# EAGLE design EmonMbed (EAGLE 7.2.0)
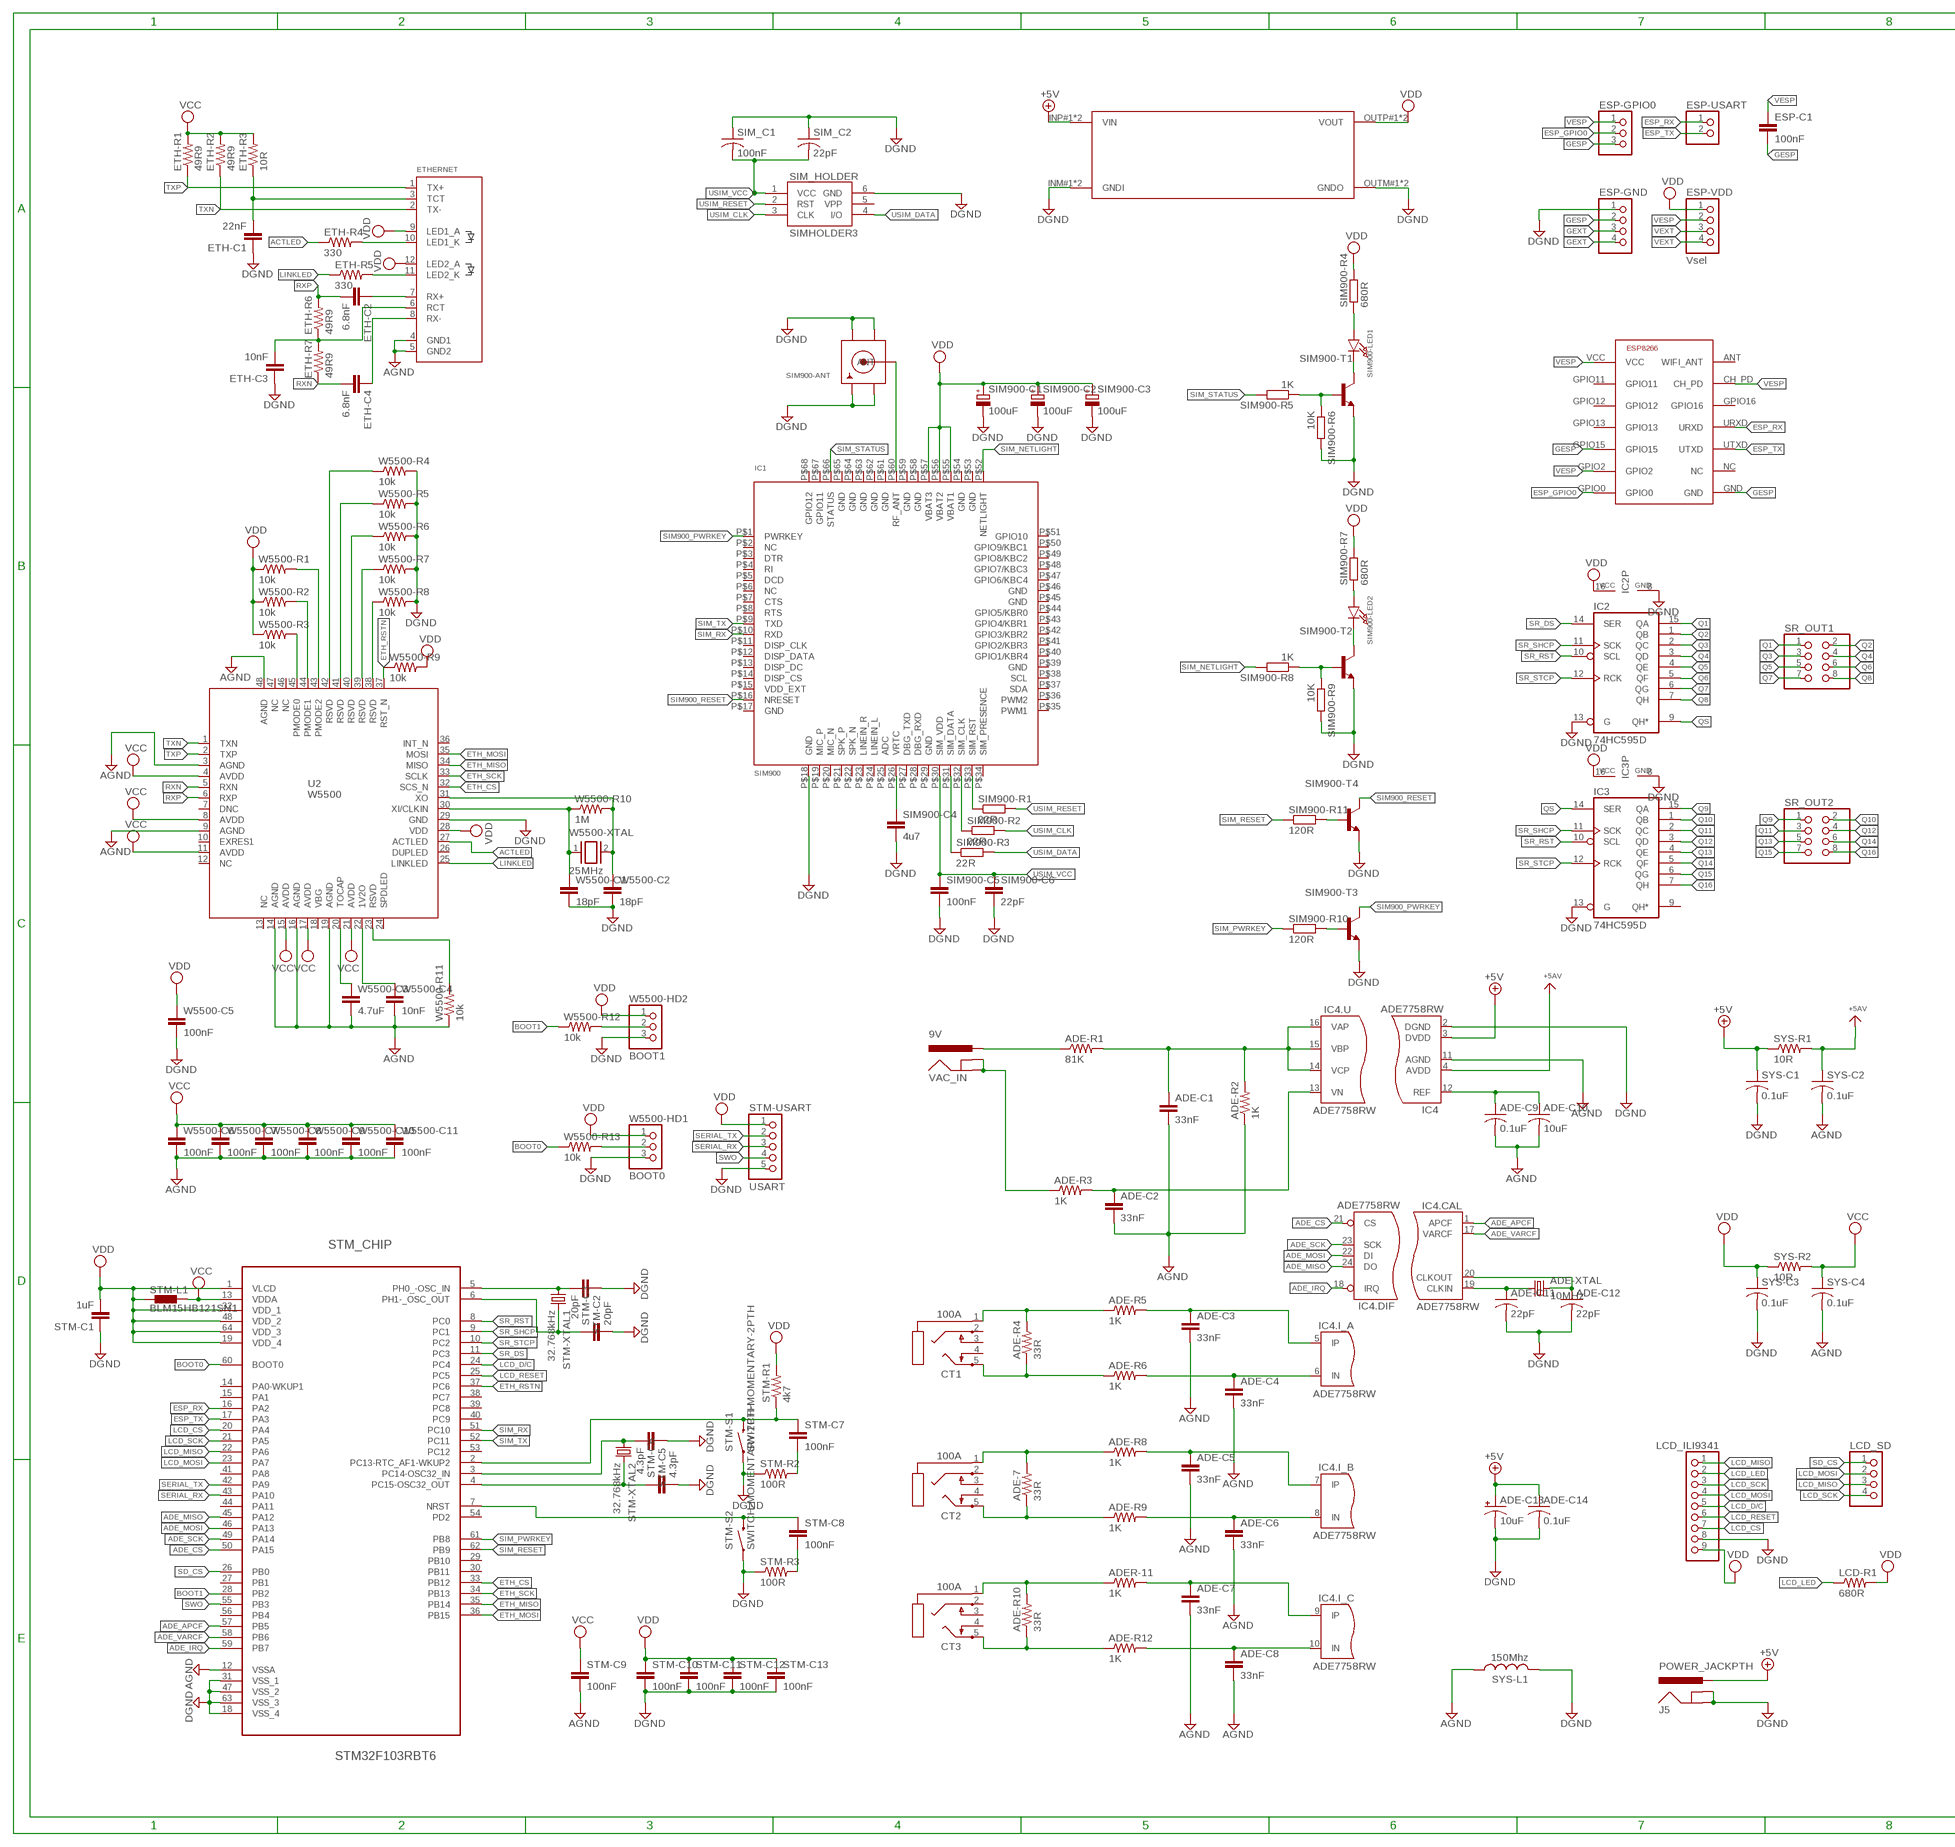
[diagram p0: schematic, sheet 1, part 1 of 2]
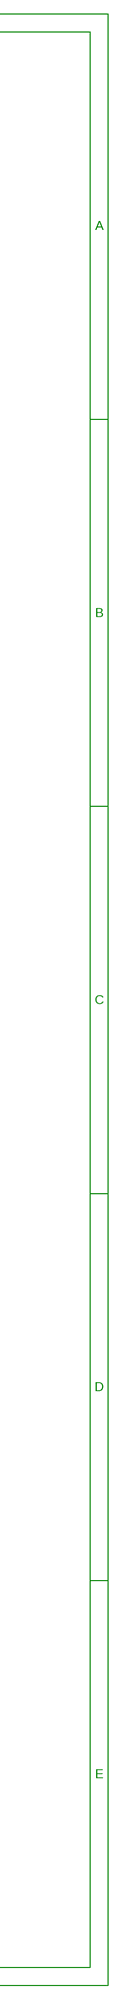
[diagram p1: schematic, sheet 1, part 2 of 2]

## Parts
ADE-7  33R  RESISTOR0603-RES  [0603-RES]
ADE-C1  33nF  CAP0603-CAP  [0603-CAP]
ADE-C2  33nF  CAP0603-CAP  [0603-CAP]
ADE-C3  33nF  CAP0603-CAP  [0603-CAP]
ADE-C4  33nF  CAP0603-CAP  [0603-CAP]
ADE-C5  33nF  CAP0603-CAP  [0603-CAP]
ADE-C6  33nF  CAP0603-CAP  [0603-CAP]
ADE-C7  33nF  CAP0603-CAP  [0603-CAP]
ADE-C8  33nF  CAP0603-CAP  [0603-CAP]
ADE-C9  0.1uF  C-USC0805K  [C0805K]
ADE-C10  10uF  C-USC0805K  [C0805K]
ADE-C11  22pF  C-USC0805K  [C0805K]
ADE-C12  22pF  C-USC0805K  [C0805K]
ADE-C13  10uF  CPOL-USC/6032-28R  [C/6032-28R]
ADE-C14  0.1uF  C-USC0805  [C0805]
ADE-R1  81K  RESISTOR0603-RES  [0603-RES]
ADE-R2  1K  RESISTOR0603-RES  [0603-RES]
ADE-R3  1K  RESISTOR0603-RES  [0603-RES]
ADE-R4  33R  RESISTOR0603-RES  [0603-RES]
ADE-R5  1K  RESISTOR0603-RES  [0603-RES]
ADE-R6  1K  RESISTOR0603-RES  [0603-RES]
ADE-R8  1K  RESISTOR0603-RES  [0603-RES]
ADE-R9  1K  RESISTOR0603-RES  [0603-RES]
ADE-R10  33R  RESISTOR0603-RES  [0603-RES]
ADE-R12  1K  RESISTOR0603-RES  [0603-RES]
ADE-XTAL  10MHz  CRYSTALHC49US  [HC49US]
ADER-11  1K  RESISTOR0603-RES  [0603-RES]
CT1  100A  AUDIO_STEREOJACK  [STX3100]
CT2  100A  AUDIO_STEREOJACK  [STX3100]
CT3  100A  AUDIO_STEREOJACK  [STX3100]
DCDC-3.5V  DCDCMODULE_SMALL  [DCDCMODULE-SMALL]
ESP8266  ESP-07  [ESP-07]
ESP-C1  100nF  C-EUC0603  [C0603]
ESP-GND  PINHD-1X4  [1X04]
ESP-GPIO0  PINHD-1X3  [1X03]
ESP-USART  PINHD-1X2  [1X02]
ESP-VDD  Vsel  PINHD-1X4  [1X04]
ETH-C1  22nF  C-EUC0603  [C0603]
ETH-C2  6.8nF  C-EUC0603  [C0603]
ETH-C3  10nF  C-EUC0603  [C0603]
ETH-C4  6.8nF  C-EUC0603  [C0603]
ETH-R1  49R9  R-US_R0603  [R0603]
ETH-R2  49R9  R-US_R0603  [R0603]
ETH-R3  10R  R-US_R0603  [R0603]
ETH-R4  330  R-US_R0603  [R0603]
ETH-R5  330  R-US_R0603  [R0603]
ETH-R6  49R9  R-US_R0603  [R0603]
ETH-R7  49R9  R-US_R0603  [R0603]
ETHERNET  RJ45J0026D21BNL  [RJ45_PULSEJACK]
IC1  SIM900  GSM_SIM900_LITERAL  [SIM900_SMT]
IC2  74HC595D  [SO16]
IC3  74HC595D  [SO16]
IC4  ADE7758RW  [SOIC24]
J5  POWER_JACKPTH  [POWER_JACK_PTH]
LCD-R1  680R  RESISTOR0603-RES  [0603-RES]
LCD_ILI9341  PINHD-1X9  [1X09]
LCD_SD  PINHD-1X4  [1X04]
SIM900-ANT  SMACONNECTOR  [SMA90_DIP]
SIM900-C1  100uF  CPOL-EU153CLV-0605  [153CLV-0605]
SIM900-C2  100uF  CPOL-EU153CLV-0605  [153CLV-0605]
SIM900-C3  100uF  CPOL-EU153CLV-0605  [153CLV-0605]
SIM900-C4  4u7  C-EUC0603  [C0603]
SIM900-C5  100nF  C-EUC0603  [C0603]
SIM900-C6  22pF  C-EUC0603  [C0603]
SIM900-LED1  LED0805_NOOUTLINE  [CHIPLED_0805_NOOUTLINE]
SIM900-LED2  LED0805_NOOUTLINE  [CHIPLED_0805_NOOUTLINE]
SIM900-R1  22R  R-EU_R0603  [R0603]
SIM900-R2  22R  R-EU_R0603  [R0603]
SIM900-R3  22R  R-EU_R0603  [R0603]
SIM900-R4  680R  R-EU_R0603  [R0603]
SIM900-R5  1K  R-EU_R0603  [R0603]
SIM900-R6  10K  R-EU_R0603  [R0603]
SIM900-R7  680R  R-EU_R0603  [R0603]
SIM900-R8  1K  R-EU_R0603  [R0603]
SIM900-R9  10K  R-EU_R0603  [R0603]
SIM900-R10  120R  R-EU_R0603  [R0603]
SIM900-R11  120R  R-EU_R0603  [R0603]
SIM900-T1  MMBT2222ALT1-NPN-SOT23-BEC  [SOT23-BEC]
SIM900-T2  MMBT2222ALT1-NPN-SOT23-BEC  [SOT23-BEC]
SIM900-T3  MMBT2222ALT1-NPN-SOT23-BEC  [SOT23-BEC]
SIM900-T4  MMBT2222ALT1-NPN-SOT23-BEC  [SOT23-BEC]
SIM_C1  100nF  C-USC0603K  [C0603K]
SIM_C2  22pF  C-USC0603K  [C0603K]
SIM_HOLDER  SIMHOLDER3  [SIMHOLDER3]
SR_OUT1  PINHD-2X4/90  [2X04/90]
SR_OUT2  PINHD-2X4/90  [2X04/90]
STM-C1  1uF  C-EUC0603  [C0603]
STM-C2  20pF  C-EUC0603  [C0603]
STM-C3  20pF  C-EUC0603  [C0603]
STM-C5  4.3pF  C-EUC0603  [C0603]
STM-C6  4.3pF  C-EUC0603  [C0603]
STM-C7  100nF  C-EUC0603  [C0603]
STM-C8  100nF  C-EUC0603  [C0603]
STM-C9  100nF  C-EUC0603  [C0603]
STM-C10  100nF  C-EUC0603  [C0603]
STM-C11  100nF  C-EUC0603  [C0603]
STM-C12  100nF  C-EUC0603  [C0603]
STM-C13  100nF  C-EUC0603  [C0603]
STM-L1  BLM15HB121SN1  [0402]
STM-R1  4k7  R-US_R0603  [R0603]
STM-R2  100R  R-US_R0603  [R0603]
STM-R3  100R  R-US_R0603  [R0603]
STM-S1  SWITCH-MOMENTARY-2PTH  [TACTILE-PTH]
STM-S2  SWITCH-MOMENTARY-2PTH  [TACTILE-PTH]
STM-USART  USART  PINHD-1X5  [1X05]
STM-XTAL1  32.768kHz  CRYSTALTC26H  [TC26H]
STM-XTAL2  32.768kHz  CRYSTALTC26H  [TC26H]
STM_CHIP  STM32F103RBT6  STM32L152RBT6  [QFP50P1200X1200X160-64N]
SYS-C1  0.1uF  C-USC0805  [C0805]
SYS-C2  0.1uF  C-USC0805  [C0805]
SYS-C3  0.1uF  C-USC0805  [C0805]
SYS-C4  0.1uF  C-USC0805  [C0805]
SYS-L1  150Mhz  L-USWE-TPC  [POWER-CHOKE_WE-TPC]
SYS-R1  10R  RESISTOR0603-RES  [0603-RES]
SYS-R2  10R  RESISTOR0603-RES  [0603-RES]
U2  W5500  [W5500]
VAC_IN  9V  POWER_JACKPTH  [POWER_JACK_PTH]
W5500-C1  18pF  C-EUC0603  [C0603]
W5500-C2  18pF  C-EUC0603  [C0603]
W5500-C3  4.7uF  C-EUC0603  [C0603]
W5500-C4  10nF  C-EUC0603  [C0603]
W5500-C5  100nF  C-EUC0603  [C0603]
W5500-C6  100nF  C-EUC0603  [C0603]
W5500-C7  100nF  C-EUC0603  [C0603]
W5500-C8  100nF  C-EUC0603  [C0603]
W5500-C9  100nF  C-EUC0603  [C0603]
W5500-C10  100nF  C-EUC0603  [C0603]
W5500-C11  100nF  C-EUC0603  [C0603]
W5500-HD1  BOOT0  PINHD-1X3  [1X03]
W5500-HD2  BOOT1  PINHD-1X3  [1X03]
W5500-R1  10k  R-US_R0603  [R0603]
W5500-R2  10k  R-US_R0603  [R0603]
W5500-R3  10k  R-US_R0603  [R0603]
W5500-R4  10k  R-US_R0603  [R0603]
W5500-R5  10k  R-US_R0603  [R0603]
W5500-R6  10k  R-US_R0603  [R0603]
W5500-R7  10k  R-US_R0603  [R0603]
W5500-R8  10k  R-US_R0603  [R0603]
W5500-R9  10k  R-US_R0603  [R0603]
W5500-R10  1M  R-US_R0603  [R0603]
W5500-R11  10k  R-US_R0603  [R0603]
W5500-R12  10k  R-US_R0603  [R0603]
W5500-R13  10k  R-US_R0603  [R0603]
W5500-XTAL  25MHz  XTAL/S  [QS]

## Nets
+5V [power]: ADE-C13.+ ADE-C14.1 DCDC-3.5V.INP#1(VIN) DCDC-3.5V.INP#2(VIN) IC4.3(DVDD) J5.PWR SYS-C1.1 SYS-R1.1
ACTLED: ETH-R4.1 U2.27(ACTLED)
ADE_APCF: IC4.1(APCF) STM_CHIP.57(PB5)
ADE_CS: IC4.21(CS) STM_CHIP.50(PA15)
ADE_IRQ: IC4.18(IRQ) STM_CHIP.59(PB7)
ADE_MISO: IC4.24(DO) STM_CHIP.45(PA12)
ADE_MOSI: IC4.22(DI) STM_CHIP.46(PA13)
ADE_SCK: IC4.23(SCK) STM_CHIP.49(PA14)
ADE_VARCF: IC4.17(VARCF) STM_CHIP.58(PB6)
AGND: ADE-C1.2 ADE-C2.2 ADE-C3.2 ADE-C4.2 ADE-C5.2 ADE-C6.2 ADE-C7.2 ADE-C8.2 ADE-C9.2 ADE-C10.2 ADE-R2.1 ETHERNET.4(GND1) ETHERNET.5(GND2) IC4.11(AGND) STM-C9.2 STM_CHIP.12(VSSA) SYS-C2.2 SYS-C4.2 SYS-L1.1 U2.3(AGND) U2.9(AGND) U2.14(AGND) U2.16(AGND) U2.19(AGND) U2.48(AGND) W5500-C3.2 W5500-C4.2 W5500-C6.2 W5500-C7.2 W5500-C8.2 W5500-C9.2 W5500-C10.2 W5500-C11.2 W5500-R11.1
AVDD: IC4.4(AVDD) SYS-C2.1 SYS-R1.2 ; supply symbol labelled +5AV
BOOT0: STM_CHIP.60(BOOT0) W5500-R13.1
BOOT1: STM_CHIP.28(PB2) W5500-R12.1
DGND: ADE-C11.2 ADE-C12.2 ADE-C13.- ADE-C14.2 DCDC-3.5V.INM#1(GNDI) DCDC-3.5V.INM#2(GNDI) DCDC-3.5V.OUTM#1(GNDO) DCDC-3.5V.OUTM#2(GNDO) ESP-GND.1 ETH-C1.1 ETH-C3.1 IC1.P$18(GND) IC2.8(GND) IC2.13(G) IC3.8(GND) IC3.13(G) IC4.2(DGND) J5.GND J5.GNDBREAK LCD_ILI9341.8 SIM900-ANT.GND1 SIM900-ANT.GND2 SIM900-ANT.GND3 SIM900-ANT.GND4 SIM900-C1.- SIM900-C2.- SIM900-C3.- SIM900-C4.2 SIM900-C5.2 SIM900-C6.2 SIM900-R6.2 SIM900-R9.2 SIM900-T1.E SIM900-T2.E SIM900-T3.E SIM900-T4.E SIM_C1.1 SIM_C2.1 SIM_HOLDER.6(GND) STM-C1.1 STM-C2.1 STM-C3.2 STM-C5.1 STM-C6.2 STM-C10.2 STM-C11.2 STM-C12.2 STM-C13.2 STM-R2.1 STM-R3.1 STM-S1.1 STM-S2.1 STM-USART.5 STM_CHIP.18(VSS_4) STM_CHIP.31(VSS_1) STM_CHIP.47(VSS_2) STM_CHIP.63(VSS_3) SYS-C1.2 SYS-C3.2 SYS-L1.2 U2.29(GND) W5500-C1.2 W5500-C2.2 W5500-C5.2 W5500-HD1.3 W5500-HD2.3 W5500-R4.2 W5500-R5.2 W5500-R6.2 W5500-R7.2 W5500-R8.2
ESP_GPIO0: ESP8266.GPIO0 ESP-GPIO0.2
ESP_RX: ESP8266.URXD ESP-USART.1 STM_CHIP.16(PA2)
ESP_TX: ESP8266.UTXD ESP-USART.2 STM_CHIP.17(PA3)
ETH_CS: STM_CHIP.33(PB12) U2.32(SCS_N)
ETH_MISO: STM_CHIP.35(PB14) U2.34(MISO)
ETH_MOSI: STM_CHIP.36(PB15) U2.35(MOSI)
ETH_RSTN: STM_CHIP.37(PC6) U2.37(RST_N) W5500-R9.1
ETH_SCK: STM_CHIP.34(PB13) U2.33(SCLK)
GESP: ESP8266.GND ESP8266.GPIO15 ESP-C1.2 ESP-GND.2 ESP-GPIO0.3
GEXT: ESP-GND.3 ESP-GND.4
IBN: ADE-7.1 ADE-R9.1 CT2.5
ICN: ADE-R10.1 ADE-R12.1 CT3.5
LCD_CS: LCD_ILI9341.7 STM_CHIP.20(PA4)
LCD_D/C: LCD_ILI9341.5 STM_CHIP.24(PC4)
LCD_LED: LCD-R1.1 LCD_ILI9341.2
LCD_MISO: LCD_ILI9341.1 LCD_SD.3 STM_CHIP.22(PA6)
LCD_MOSI: LCD_ILI9341.4 LCD_SD.2 STM_CHIP.23(PA7)
LCD_RESET: LCD_ILI9341.6 STM_CHIP.25(PC5)
LCD_SCK: LCD_ILI9341.3 LCD_SD.4 STM_CHIP.21(PA5)
LINKLED: ETH-R5.1 U2.25(LINKLED)
N$1: STM-C5.2 STM-XTAL2.1 STM_CHIP.3(PC14-OSC32_IN)
N$2: STM-C6.1 STM-XTAL2.2 STM_CHIP.4(PC15-OSC32_OUT)
N$3: IC1.P$31(SIM_DATA) SIM900-R3.1
N$4: STM-C7.1 STM-R1.1 STM-S1.3 STM_CHIP.2(PC13-RTC_AF1-WKUP2)
N$5: STM-C7.2 STM-R2.2
N$6: STM-C2.2 STM-XTAL1.1 STM_CHIP.5(PH0_-OSC_IN)
N$7: STM-C3.1 STM-XTAL1.2 STM_CHIP.6(PH1-_OSC_OUT)
N$8: IC1.P$32(SIM_CLK) SIM900-R2.1
N$9: STM-C8.2 STM-R3.2
N$11: ETH-R4.2 ETHERNET.10(LED1_K)
N$12: ETH-R5.2 ETHERNET.11(LED2_K)
N$13: IC1.P$33(SIM_RST) SIM900-R1.1
N$14: IC1.P$26(VRTC) SIM900-C4.1
N$15: IC1.P$60(RF_ANT) SIM900-ANT.ANTENNA(ANT)
N$16: SIM900-LED1.A SIM900-R4.1
N$17: SIM900-LED1.C SIM900-T1.C
N$18: SIM900-R5.1 SIM900-R6.1 SIM900-T1.B
N$19: SIM900-LED2.A SIM900-R7.1
N$20: SIM900-LED2.C SIM900-T2.C
N$21: SIM900-R8.1 SIM900-R9.1 SIM900-T2.B
N$22: ETH-C2.1 ETHERNET.7(RX+)
N$23: ETH-C1.2 ETH-R3.1 ETHERNET.3(TCT)
N$24: ADE-C7.1 ADER-11.2 IC4.9(IP)
N$25: ADE-7.2 ADE-R8.1 CT2.1
N$26: ETH-C4.1 ETHERNET.8(RX-)
N$27: ADE-C3.1 ADE-R5.2 IC4.5(IP)
N$28: ADE-C4.1 ADE-R6.2 IC4.6(IN)
N$29: ETH-C3.2 ETH-R6.1 ETH-R7.2 ETHERNET.6(RCT)
N$30: ADE-C6.1 ADE-R9.2 IC4.8(IN)
N$31: ADE-C5.1 ADE-R8.2 IC4.7(IP)
N$32: ADE-C9.1 ADE-C10.1 IC4.12(REF)
N$33: ADE-C11.1 ADE-XTAL.1 IC4.19(CLKIN)
N$34: ADE-C12.1 ADE-XTAL.2 IC4.20(CLKOUT)
N$35: ADE-C2.1 ADE-R3.2 IC4.13(VN)
N$36: ADE-R1.1 VAC_IN.PWR
N$37: ADE-C1.1 ADE-R1.2 ADE-R2.2 IC4.14(VCP) IC4.15(VBP) IC4.16(VAP)
N$38: U2.20(TOCAP) W5500-C3.1
N$39: ADE-R4.2 ADE-R5.1 CT1.1
N$40: ADE-C8.1 ADE-R12.2 IC4.10(IN)
N$41: U2.22(1V2O) W5500-C4.1
N$42: U2.23(RSVD) W5500-R11.2
N$43: W5500-HD1.2 W5500-R13.2
N$44: SIM900-R10.2 SIM900-T3.B
N$45: SIM900-R11.2 SIM900-T4.B
N$46: W5500-HD2.2 W5500-R12.2
N$47: ADE-R4.1 ADE-R6.1 CT1.5
N$48: ADE-R10.2 ADER-11.1 CT3.1
N$49: U2.30(XI/CLKIN) W5500-C1.1 W5500-R10.1 W5500-XTAL.1
N$50: U2.31(XO) W5500-C2.1 W5500-R10.2 W5500-XTAL.2
N$51: ADE-R3.1 VAC_IN.GND VAC_IN.GNDBREAK
N$57: U2.38(RSVD) W5500-R8.1
N$58: U2.39(RSVD) W5500-R7.1
N$59: U2.40(RSVD) W5500-R6.1
N$60: U2.41(RSVD) W5500-R5.1
N$61: U2.42(RSVD) W5500-R4.1
N$62: U2.43(PMODE2) W5500-R1.2
N$63: U2.44(PMODE1) W5500-R2.2
N$64: U2.45(PMODE0) W5500-R3.2
NRST: STM-C8.1 STM-S2.3 STM_CHIP.7(NRST)
Q1: IC2.15(QA) SR_OUT1.1
Q2: IC2.1(QB) SR_OUT1.2
Q3: IC2.2(QC) SR_OUT1.3
Q4: IC2.3(QD) SR_OUT1.4
Q5: IC2.4(QE) SR_OUT1.5
Q6: IC2.5(QF) SR_OUT1.6
Q7: IC2.6(QG) SR_OUT1.7
Q8: IC2.7(QH) SR_OUT1.8
Q9: IC3.15(QA) SR_OUT2.1
Q10: IC3.1(QB) SR_OUT2.2
Q11: IC3.2(QC) SR_OUT2.3
Q12: IC3.3(QD) SR_OUT2.4
Q13: IC3.4(QE) SR_OUT2.5
Q14: IC3.5(QF) SR_OUT2.6
Q15: IC3.6(QG) SR_OUT2.7
Q16: IC3.7(QH) SR_OUT2.8
QS: IC2.9(QH*) IC3.14(SER)
RXN: ETH-C4.2 ETH-R7.1 U2.5(RXN)
RXP: ETH-C2.2 ETH-R6.2 U2.6(RXP)
SD_CS: LCD_SD.1 STM_CHIP.26(PB0)
SERIAL_RX: STM-USART.3 STM_CHIP.43(PA10)
SERIAL_TX: STM-USART.2 STM_CHIP.42(PA9)
SIM900_PWRKEY: IC1.P$1(PWRKEY) SIM900-T3.C
SIM900_RESET: IC1.P$16(NRESET) SIM900-T4.C
SIM_NETLIGHT: IC1.P$52(NETLIGHT) SIM900-R8.2
SIM_PWRKEY: SIM900-R10.1 STM_CHIP.61(PB8)
SIM_RESET: SIM900-R11.1 STM_CHIP.62(PB9)
SIM_RX: IC1.P$10(RXD) STM_CHIP.51(PC10)
SIM_STATUS: IC1.P$66(STATUS) SIM900-R5.2
SIM_TX: IC1.P$9(TXD) STM_CHIP.52(PC11)
SR_DS: IC2.14(SER) STM_CHIP.11(PC3)
SR_RST: IC2.10(SCL) IC3.10(SCL) STM_CHIP.8(PC0)
SR_SHCP: IC2.11(SCK) IC3.11(SCK) STM_CHIP.9(PC1)
SR_STCP: IC2.12(RCK) IC3.12(RCK) STM_CHIP.10(PC2)
SWO: STM-USART.4 STM_CHIP.55(PB3)
TXN: ETH-R2.1 ETHERNET.2(TX-) U2.1(TXN)
TXP: ETH-R1.1 ETHERNET.1(TX+) U2.2(TXP)
USIM_CLK: SIM900-R2.2 SIM_HOLDER.3(CLK)
USIM_DATA: SIM900-R3.2 SIM_HOLDER.4(I/O)
USIM_RESET: SIM900-R1.2 SIM_HOLDER.2(RST)
USIM_VCC: IC1.P$30(SIM_VDD) SIM900-C5.1 SIM900-C6.1 SIM_C1.2 SIM_C2.2 SIM_HOLDER.1(VCC)
VCC: ETH-R1.2 ETH-R2.2 ETH-R3.2 STM-C9.1 STM-L1.2 STM_CHIP.13(VDDA) SYS-C4.1 SYS-R2.2 U2.4(AVDD) U2.8(AVDD) U2.11(AVDD) U2.15(AVDD) U2.17(AVDD) U2.21(AVDD) W5500-C6.1 W5500-C7.1 W5500-C8.1 W5500-C9.1 W5500-C10.1 W5500-C11.1
VDD: DCDC-3.5V.OUTP#1(VOUT) DCDC-3.5V.OUTP#2(VOUT) ESP-VDD.1 ETHERNET.9(LED1_A) ETHERNET.12(LED2_A) IC1.P$55(VBAT1) IC1.P$56(VBAT2) IC1.P$57(VBAT3) IC2.16(VCC) IC3.16(VCC) LCD-R1.2 LCD_ILI9341.9 SIM900-C1.+ SIM900-C2.+ SIM900-C3.+ SIM900-R4.2 SIM900-R7.2 STM-C1.2 STM-C10.1 STM-C11.1 STM-C12.1 STM-C13.1 STM-L1.1 STM-R1.2 STM-USART.1 STM_CHIP.1(VLCD) STM_CHIP.19(VDD_4) STM_CHIP.32(VDD_1) STM_CHIP.48(VDD_2) STM_CHIP.64(VDD_3) SYS-C3.1 SYS-R2.1 U2.28(VDD) W5500-C5.1 W5500-HD1.1 W5500-HD2.1 W5500-R1.1 W5500-R2.1 W5500-R3.1 W5500-R9.2
VESP: ESP8266.CH_PD ESP8266.GPIO2 ESP8266.VCC ESP-C1.1 ESP-GPIO0.1 ESP-VDD.2
VEXT: ESP-VDD.3 ESP-VDD.4
Unconnected: CT1.2 CT1.3 CT1.4 CT2.2 CT2.3 CT2.4 CT3.2 CT3.3 CT3.4 ESP8266.ANT(WIFI_ANT) ESP8266.GPIO11 ESP8266.GPIO12 ESP8266.GPIO13 ESP8266.GPIO16 ESP8266.NC IC1.P$2(NC) IC1.P$3(DTR) IC1.P$4(RI) IC1.P$5(DCD) IC1.P$6(NC) IC1.P$7(CTS) IC1.P$8(RTS) IC1.P$11(DISP_CLK) IC1.P$12(DISP_DATA) IC1.P$13(DISP_DC) IC1.P$14(DISP_CS) IC1.P$15(VDD_EXT) IC1.P$19(MIC_P) IC1.P$20(MIC_N) IC1.P$21(SPK_P) IC1.P$22(SPK_N) IC1.P$23(LINEIN_R) IC1.P$24(LINEIN_L) IC1.P$25(ADC) IC1.P$27(DBG_TXD) IC1.P$28(DBG_RXD) IC1.P$34(SIM_PRESENCE) IC1.P$35(PWM1) IC1.P$36(PWM2) IC1.P$37(SDA) IC1.P$38(SCL) IC1.P$40(GPIO1/KBR4) IC1.P$41(GPIO2/KBR3) IC1.P$42(GPIO3/KBR2) IC1.P$43(GPIO4/KBR1) IC1.P$44(GPIO5/KBR0) IC1.P$47(GPIO6/KBC4) IC1.P$48(GPIO7/KBC3) IC1.P$49(GPIO8/KBC2) IC1.P$50(GPIO9/KBC1) IC1.P$51(GPIO10) IC3.9(QH*) SIM_HOLDER.5(VPP) STM_CHIP.14(PA0-WKUP1) STM_CHIP.15(PA1) STM_CHIP.27(PB1) STM_CHIP.29(PB10) STM_CHIP.30(PB11) STM_CHIP.38(PC7) STM_CHIP.39(PC8) STM_CHIP.40(PC9) STM_CHIP.41(PA8) STM_CHIP.44(PA11) STM_CHIP.53(PC12) STM_CHIP.54(PD2) STM_CHIP.56(PB4) U2.7(DNC) U2.10(EXRES1) U2.12(NC) U2.13(NC) U2.18(VBG) U2.24(SPDLED) U2.26(DUPLED) U2.36(INT_N) U2.46(NC) U2.47(NC)

## Power pins joined to a net without a drawn wire
GND: IC1.P$17(GND) IC1.P$29(GND) IC1.P$39(GND) IC1.P$45(GND) IC1.P$46(GND) IC1.P$53(GND) IC1.P$54(GND) IC1.P$58(GND) IC1.P$59(GND) IC1.P$61(GND) IC1.P$62(GND) IC1.P$63(GND) IC1.P$64(GND) IC1.P$65(GND)
GPIO11: IC1.P$67(GPIO11)
GPIO12: IC1.P$68(GPIO12)

## Library data of the parts
ADE-7 ADE-R1-ADE-R6 ADE-R8-ADE-R10 ADE-R12 ADER-11 LCD-R1 SYS-R1 SYS-R2 = SparkFun-Passives:RESISTOR: Resistor Basic schematic elements and footprints for 0603, 1206, and PTH resistors.
ADE-C1-ADE-C8 = SparkFun-Passives:CAP: Capacitor Standard 0603 ceramic capacitor, and 0.1" leaded capacitor.
ADE-C9-ADE-C12 ADE-C14 SIM_C1 SIM_C2 SYS-C1-SYS-C4 = rcl:C-US: CAPACITOR, American symbol
ADE-C13 = rcl:CPOL-US: POLARIZED CAPACITOR, American symbol
ADE-XTAL STM-XTAL1 STM-XTAL2 = SparkFun-FreqCtrl:CRYSTAL: Various standard crystals. Proven footprints. Spark Fun Electronics SKU : COM-00534
CT1-CT3 = microbuilder:AUDIO_STEREOJACK: MIC/HEADPHONE JACK Stereo jack with two switches. Kycon STX3100, CUI SJ1-3555NG and/or 4UCon 05544 Digikey: CP1-3555NG-ND Shamelessly taken from the Adafruit Eagle library (public domain) ... thanks! These are normally connected as follows, from right-to-left on the schematic symbol above: Tip: Left Audio Inner Ring: Right Audio Shell: Common/GND
DCDC-3.5V = bontor:DCDCMODULE_SMALL
ESP8266 = esp-07:ESP-07
ESP-C1 ETH-C1-ETH-C4 SIM900-C4-SIM900-C6 STM-C1-STM-C3 STM-C5-STM-C13 W5500-C1-W5500-C11 = rcl:C-EU: CAPACITOR, European symbol
ESP-GND ESP-VDD LCD_SD = pinhead:PINHD-1X4: PIN HEADER
ESP-GPIO0 W5500-HD1 W5500-HD2 = pinhead:PINHD-1X3: PIN HEADER
ESP-USART = pinhead:PINHD-1X2: PIN HEADER
ETH-R1-ETH-R7 STM-R1-STM-R3 W5500-R1-W5500-R13 = resistor:R-US_: RESISTOR, American symbol
ETHERNET = microbuilder:RJ45: RJ45 (Ethernet) Connectors J0026D21BNL - RJ45 Connector with internal transformer and 2 LEDs (Yellow/Green). LEDs have max foreward-voltage of 2.5V. LEDs require an external resistor. Digikey: 553-1349-ND J00-0065NL - RJ45 Connector with internal transformer and 2 LEDs (Yellow/Green). LEDs have max foreward-voltage of 2.5V. LEDs require an external resistor. Digikey: 553-1345-ND
IC1 = microbuilder:GSM_SIM900_LITERAL: SIM900 Quad-Band GSM/GPRS Module Power Supply: 3.2-4.8V Temperature Range: -30°C-+80°C Bands: GSM 850, EGSM 900, DCS 1800, PCS 1900
IC2 IC3 = 74xx-eu:74*595: 8-bit SHIFT REGISTER, output latch
IC4 = ade7758:ADE7758: Poly Phase Multifunction Energy Metering IC with Per Phase Information FEATURES Highly accurate; supports IEC 60687, IEC 61036, IEC 61268, IEC 62053-21, IEC 62053-22, and IEC 62053-23 Compatible with 3-phase/3-wire, 3-phase/4-wire, and other 3-phase services Less than 0.1% active energy error over a dynamic range of 1000 to 1 at 25°C Supplies active/reactive/apparent energy, voltage rms, current rms, and sampled waveform data Two pulse outputs, one for active power and the other selectable between reactive and apparent power with programmable frequency Digital power, phase, and rms offset calibration On-chip, user-programmable thresholds for line voltage SAG and overvoltage detections An on-chip, digital integrator enables direct interface-to-current sensors with di/dt output A PGA in the current channel allows direct interface to shunts and current transformers An SPI®-compatible serial interface with IRQ Proprietary ADCs and DSP provide high accuracy over large variations in environmental conditions and time Reference 2.4 V (drift 30 ppm/°C typical) with external overdrive capability Single 5 V supply, low power (70 mW typical)
J5 VAC_IN = SparkFun-Connectors:POWER_JACK: Power Jack This is the standard 5.5mm barrel jack for power. The PTH is the most common, proven, reliable, footprint. The Slot footprint only works if the mill layer is transmitted to the PCB fab house so be warned. Mating wall wart : TOL-00298 (and others); PROD_ID: CONN-08197
LCD_ILI9341 = pinhead:PINHD-1X9: PIN HEADER
SIM900-ANT = microbuilder:SMACONNECTOR: SMA Connector 90° DIP SMA Connector, 50 Ohm (4UConnector: 07259)
SIM900-C1-SIM900-C3 = rcl:CPOL-EU: POLARIZED CAPACITOR, European symbol
SIM900-LED1 SIM900-LED2 = microbuilder:LED: LED 0603 - 0603 Surface Mount Package 2mA: Green LED - Low Power (3.9mcd, 2ma, 1.7Vf) - Digikey: 475-2709-2-ND Orange LED - Low Power (9.8mcd, 2ma, 1.8Vf) - Digikey: 475-1194-2-ND Red LED - Low Power (5mcd, 2ma, 1.8Vf) - Digikey: 475-1195-2-ND Yellow LED - Low Power (7mcd, 2ma, 1.8Vf) - Digikey: 475-1196-2-ND 5mA: Blue LED - Low Power (17mcd, 5ma, 2.9Vf) - Digikey: LNJ937W8CRACT-ND 0805 - 0805 Surface Mount Package 2mA: Red LED (8.8mcd, 2mA, 1.8Vf, Clear) - Low Power [Digikey: 475-2510-1-ND] Green LED (5mcd, 2mA, 1.8Vf, Clear) - Low Power [Digikey: 475-2730-1-ND] Yellow LED (11.3mcd, 2mA, 1.8Vf, Clear) - Low Power [Digikey: 475-2555-1-ND] 20mA: Red LED (104mcd, 20mA, Diffused) - LS R976 [Digikey: 475-1278-6-ND] Red LED (12mcd, 20mA, 2.0Vf, Clear) - APT2012EC [Digikey: 754-1128-1-ND] Green LED (15mcd, 20mA, 2.2Vf, Clear) - APT2012GC [Digikey: 754-1131-1-ND] Orange LED (160mcd, 20mA, 2.1Vf, Clear) - APT2012SECK [Digikey: 754-1130-1-ND] 1206 - 1206 Surface Mount Package Green LED (26mcd, 20mA, Diffused) - LG N971 [Digikey: 475-1407-6-ND] Red LED (15mcd, 20mA, Diffused) - LH N974 [Digikey: 475-1416-6-ND]
SIM900-R1-SIM900-R9 = rcl:R-EU_: RESISTOR, European symbol
SIM900-R10 SIM900-R11 = resistor:R-EU_: RESISTOR, European symbol
SIM900-T1 SIM900-T2 = transistor:*-NPN-: NPN Transistror BF959 corrected 2008.03.06
SIM900-T3 SIM900-T4 = transistor-neu-to92:*-NPN-: NPN Transistror BF959 corrected 2008.03.06
SIM_HOLDER = SparkFun:SIMHOLDER3
SR_OUT1 SR_OUT2 = pinhead:PINHD-2X4: PIN HEADER
STM-L1 = inductors:BLM15H: EMIFIL (R) Chip Ferrite Bead for GHz Noise Source: http://www.murata.com/ Ferrite Bead BLM15H.pdf
STM-S1 STM-S2 = SparkFun-Electromechanical:SWITCH-MOMENTARY-2: Various NO switches- pushbuttons, reed, etc
STM-USART = pinhead:PINHD-1X5: PIN HEADER
STM_CHIP = ST Microelctronics_By_element14_Batch_1:STM32L152RBT6: Ultralow power ARM-based 32-bit MCU; MPN: STM32L152RBT6; OC_FARNELL: 2060946; OC_NEWARK: 65T3806; PACKAGE: QTP-64; SUPPLIER: STMICROELECTRONICS
SYS-L1 = rcl:L-US: INDUCTOR, American symbol
U2 = W5500:W5500
W5500-XTAL = special:XTAL/S: CRYSTAL

## Net classes
1 power: width 0.305 mm, drill 0.6 mm, clearance 0.254 mm
2 gnd: width 0.254 mm, drill 0.6 mm, clearance 0.254 mm

## Board
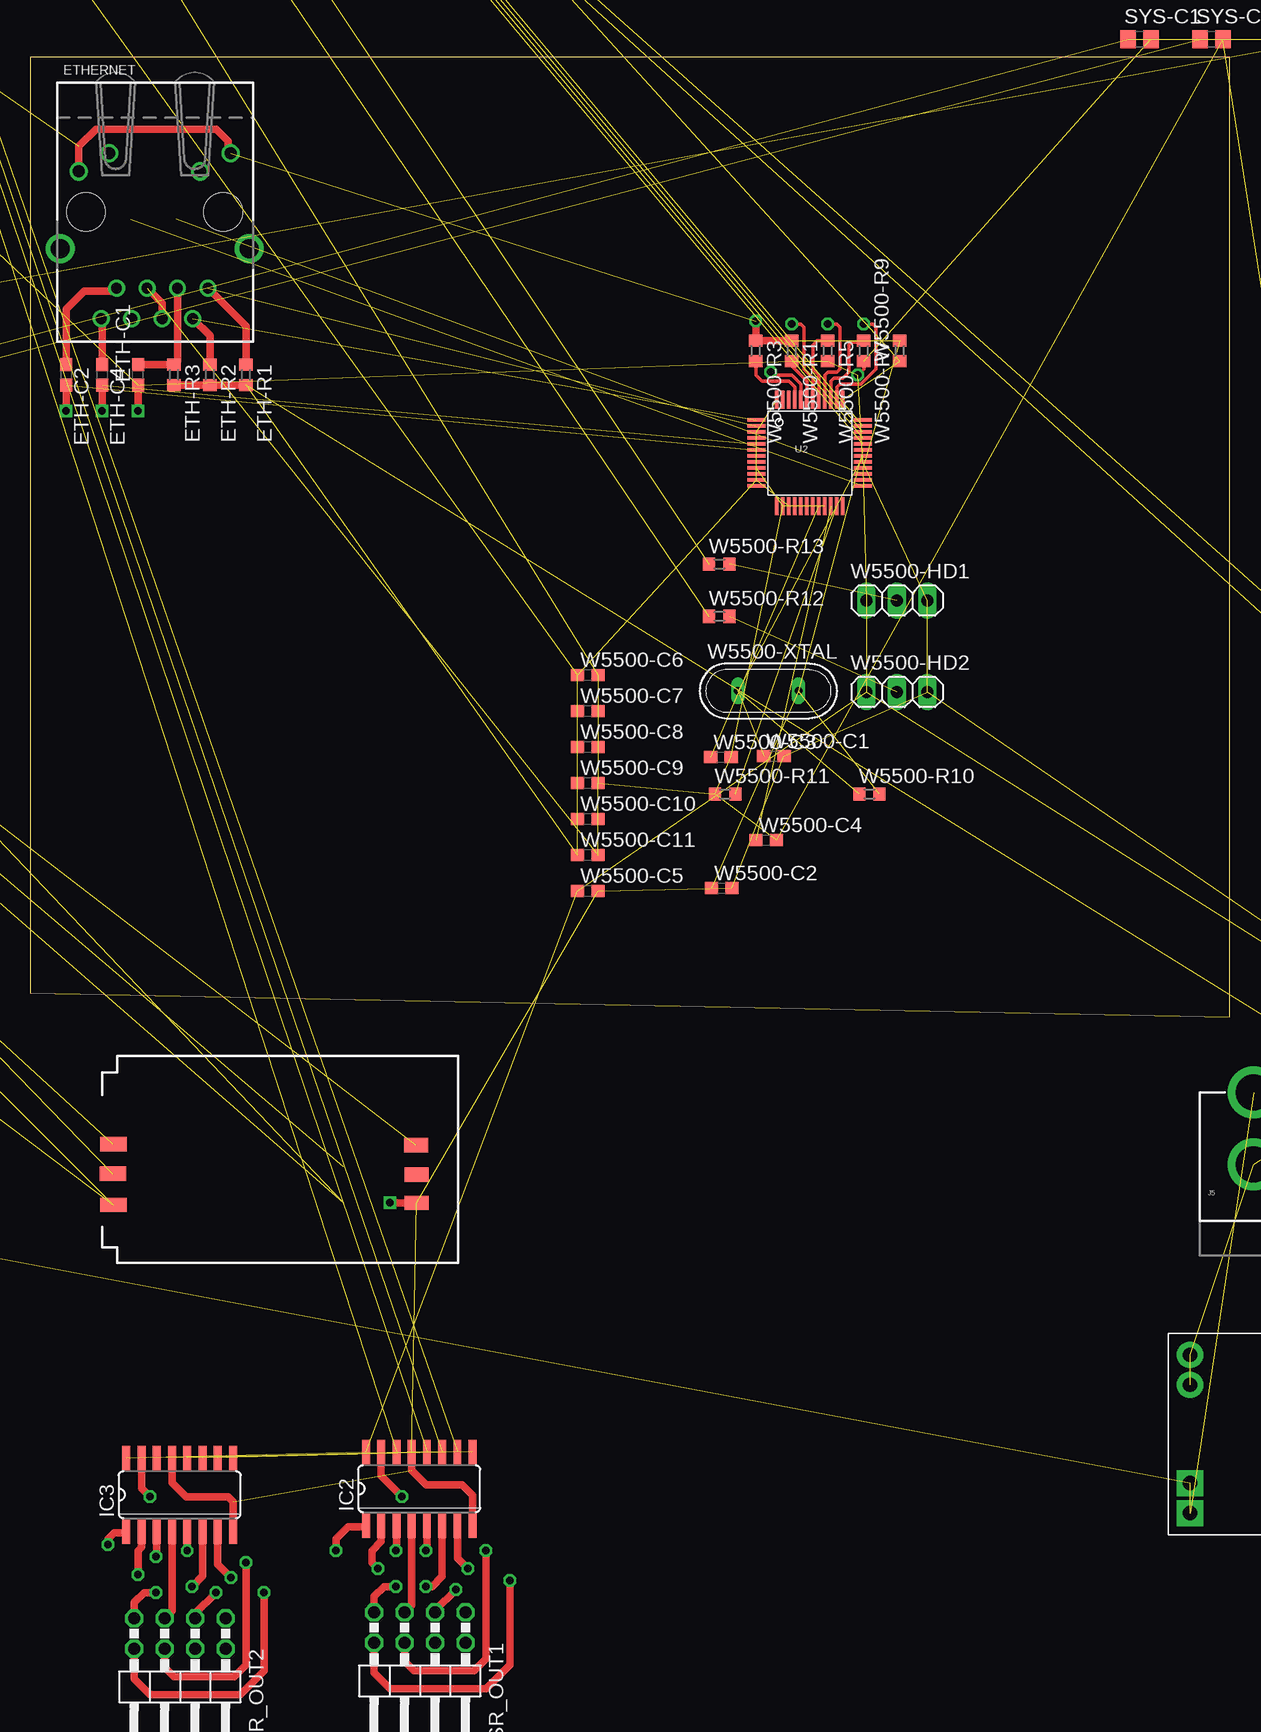
[diagram p2: board, top side]
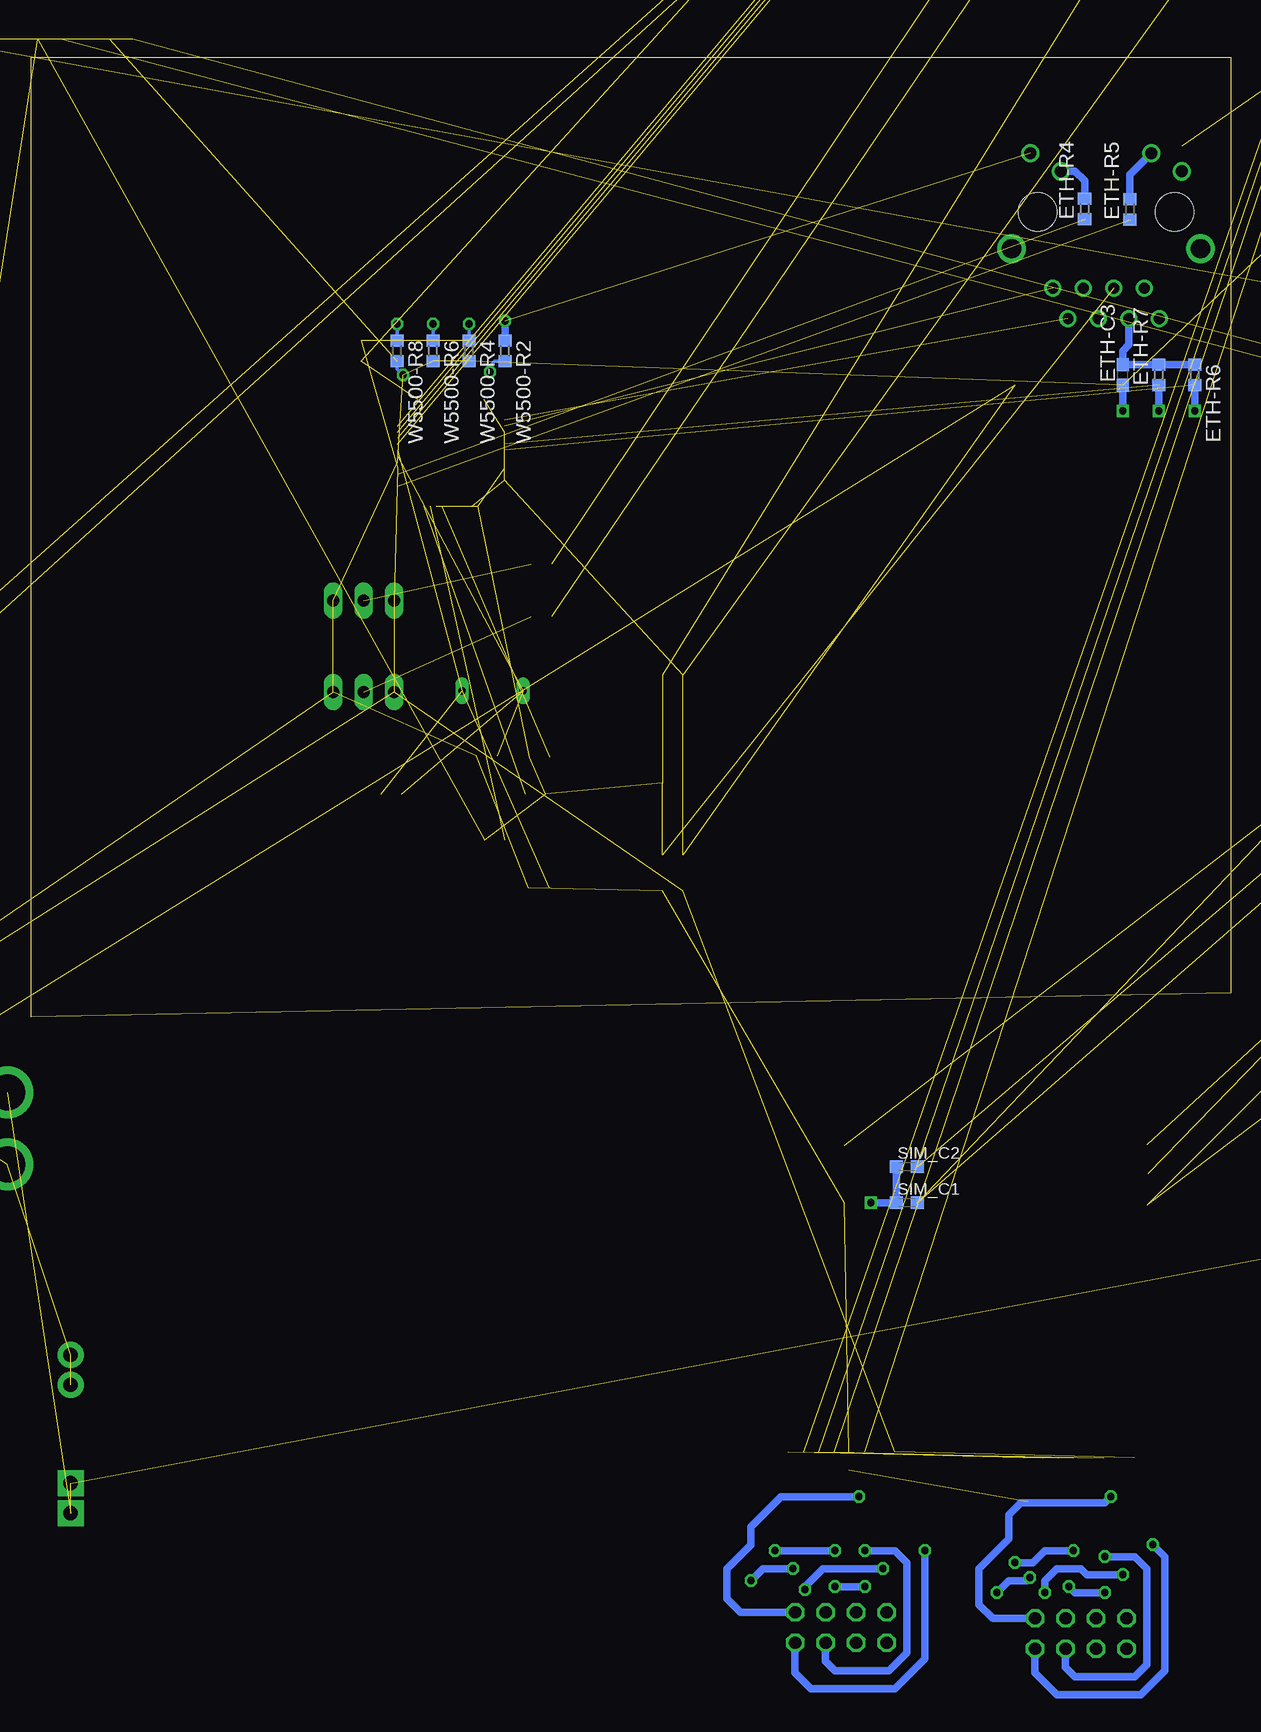
[diagram p3: board, bottom side, seen from below]

Size 100 x 80 mm. Coordinates in mm from the lower left corner, seen from the top.
Outline: 0,2 100,0 100,80 0,80 0,2
Copper layers (1*16): Top 0.035mm / dielectric 1.5mm / Bottom 0.035mm
Design rules "default": minimum track width 10mil, minimum drill 24mil, track to track 8mil, track to pad 8mil, pad to pad 8mil, via to via 8mil, smd to smd 8mil, copper to edge 40mil, drill to drill 8mil, minimum pad ring 10mil, minimum via ring 8mil, stop-mask expansion 4mil, vias tented up to drill 0mil, thermal gap 10mil

### Footprints (pad centres in the part's own frame; a part is rotated, then mirrored left to right if it is on the bottom)
0603-RES = smd 1.1 x 1: 1 -0.85,0; 2 0.85,0
0603-CAP = smd 1.1 x 1: 1 -0.85,0; 2 0.85,0
C0805K = smd 1.3 x 1.6: 1 -1,0; 2 1,0
C/6032-28R = smd 2.55 x 2.5: + 2.525,0; - -2.525,0
C0805 = smd 1.3 x 1.5: 1 -0.95,0; 2 0.95,0
HC49US = drill 0.7 pad 1.651: 1 -2.54,0; 2 2.54,0
STX3100 = drill 1.5 pad 2.54: 1 2.7,-0.1 | drill 1.5: 2 7.7,5; 3 7.7,2.3; 4 7.7,-2.5; 5 7.7,-5.2 | hole 1.5: 2.7,4.9; 2.7,-5.1; 7.7,-0.1
DCDCMODULE-SMALL = drill 1.2 pad 2.184: INM#1 1.8,15; INM#2 1.8,12.5; OUTM#1 20.3,15; OUTM#2 20.3,12.5 | drill 1.2 pad 2.184 square: INP#1 1.8,4.3; INP#2 1.8,1.8; OUTP#1 20.3,4.3; OUTP#2 20.3,1.8
ESP-07 = smd 1 x 1.5: ANT -5.59,10.47; CH_PD -3.59,10.47; GND 6.41,10.47; GPIO0 6.41,-5.93; GPIO2 4.41,-5.93; GPIO11 -3.59,-5.93; GPIO12 -1.59,-5.93; GPIO13 0.41,-5.93; GPIO15 2.41,-5.93; GPIO16 -1.59,10.47; NC 4.41,10.47; URXD 0.41,10.47; UTXD 2.41,10.47; VCC -5.59,-5.93
C0603 = smd 1.1 x 1: 1 -0.85,0; 2 0.85,0
1X04 = drill 1.016 long: 1 -3.81,0; 2 -1.27,0; 3 1.27,0; 4 3.81,0
1X03 = drill 1.016 long: 1 -2.54,0; 2 0,0; 3 2.54,0
1X02 = drill 1.016 long: 1 -1.27,0; 2 1.27,0
R0603 = smd 1 x 1.1: 1 -0.85,0; 2 0.85,0
RJ45_PULSEJACK = drill 0.9: 1 4.445,-6.35; 2 3.175,-8.89; 3 1.905,-6.35; 4 0.635,-8.89; 5 -0.635,-6.35; 6 -1.905,-8.89; 7 -3.175,-6.35; 8 -4.445,-8.89 | drill 1: 9 6.325,4.9; 10 3.785,3.38; 11 -3.785,4.9; 12 -6.325,3.38 | drill 1.6: P$5 -7.875,-3.05; P$6 7.875,-3.05 | hole 3.2: -5.715,0; 5.715,0
SIM900_SMT = smd 2 x 0.6: P$1 -12.4,8; P$2 -12.4,7; P$3 -12.4,6; P$4 -12.4,5; P$5 -12.4,4; P$6 -12.4,3; P$7 -12.4,2; P$8 -12.4,1; P$9 -12.4,0; P$10 -12.4,-1; P$11 -12.4,-2; P$12 -12.4,-3; P$13 -12.4,-4; P$14 -12.4,-5; P$15 -12.4,-6; P$16 -12.4,-7; P$17 -12.4,-8; P$35 12.4,-8; P$36 12.4,-7; P$37 12.4,-6; P$38 12.4,-5; P$39 12.4,-4; P$40 12.4,-3; P$41 12.4,-2; P$42 12.4,-1; P$43 12.4,0; P$44 12.4,1; P$45 12.4,2; P$46 12.4,3; P$47 12.4,4; P$48 12.4,5; P$49 12.4,6; P$50 12.4,7; P$51 12.4,8 | smd 0.6 x 2: P$18 -8,-12.4; P$19 -7,-12.4; P$20 -6,-12.4; P$21 -5,-12.4; P$22 -4,-12.4; P$23 -3,-12.4; P$24 -2,-12.4; P$25 -1,-12.4; P$26 0,-12.4; P$27 1,-12.4; P$28 2,-12.4; P$29 3,-12.4; P$30 4,-12.4; P$31 5,-12.4; P$32 6,-12.4; P$33 7,-12.4; P$34 8,-12.4; P$52 8,12.4; P$53 7,12.4; P$54 6,12.4; P$55 5,12.4; P$56 4,12.4; P$57 3,12.4; P$58 2,12.4; P$59 1,12.4; P$60 0,12.4; P$61 -1,12.4; P$62 -2,12.4; P$63 -3,12.4; P$64 -4,12.4; P$65 -5,12.4; P$66 -6,12.4; P$67 -7,12.4; P$68 -8,12.4
SO16 = smd 0.66 x 2.032: 1 -4.445,-3.073; 2 -3.175,-3.073; 3 -1.905,-3.073; 4 -0.635,-3.073; 5 0.635,-3.073; 6 1.905,-3.073; 7 3.175,-3.073; 8 4.445,-3.073; 9 4.445,3.073; 10 3.175,3.073; 11 1.905,3.073; 12 0.635,3.073; 13 -0.635,3.073; 14 -1.905,3.073; 15 -3.175,3.073; 16 -4.445,3.073
SOIC24 = smd 0.66 x 2.032: 1 -6.985,-5.029; 2 -5.715,-5.029; 3 -4.445,-5.029; 4 -3.175,-5.029; 5 -1.905,-5.029; 6 -0.635,-5.029; 7 0.635,-5.029; 8 1.905,-5.029; 9 3.175,-5.029; 10 4.445,-5.029; 11 5.715,-5.029; 12 6.985,-5.029; 13 6.985,5.029; 14 5.715,5.029; 15 4.445,5.029; 16 3.175,5.029; 17 1.905,5.029; 18 0.635,5.029; 19 -0.635,5.029; 20 -1.905,5.029; 21 -3.175,5.029; 22 -4.445,5.029; 23 -5.715,5.029; 24 -6.985,5.029
POWER_JACK_PTH = drill 2.997 pad 4.318: GND 0,7.7; GNDBREAK 4.7,10.7; PWR 0,13.7
1X09 = drill 1.016 long: 1 -10.16,0; 2 -7.62,0; 3 -5.08,0; 4 -2.54,0; 5 0,0; 6 2.54,0; 7 5.08,0; 8 7.62,0; 9 10.16,0
SMA90_DIP = drill 1.5 pad 2.54: ANTENNA 0,0 | drill 1.6 pad 2.54: GND1 -2.54,2.54; GND2 2.54,2.54; GND3 -2.54,-2.54; GND4 2.54,-2.54
153CLV-0605 = smd 3.5 x 1.6: + 2.7,0; - -2.7,0
CHIPLED_0805_NOOUTLINE = smd 1.2 x 1.2: A 0,-1.05; C 0,1.05
SOT23-BEC = smd 1 x 1.4: B -0.95,-1.1; C 0,1.1; E 0.95,-1.1
C0603K = smd 1.05 x 1.08: 1 -0.875,0; 2 0.875,0
SIMHOLDER3 = smd 2.2 x 1.2: 1 0.95,4.81; 2 0.91,7.41; 3 0.95,9.86 | smd 2 x 1.2: 4 26.2,9.78; 5 26.22,7.34; 6 26.22,4.98
2X04/90 = drill 1.016 octagon: 1 -3.81,-6.35; 2 -3.81,-3.81; 3 -1.27,-6.35; 4 -1.27,-3.81; 5 1.27,-6.35; 6 1.27,-3.81; 7 3.81,-6.35; 8 3.81,-3.81
0402 = smd 0.7 x 0.9: 1 -0.65,0; 2 0.65,0
TACTILE-PTH = drill 1.016 pad 1.88: 1 -3.251,2.261; 2 3.251,2.261; 3 -3.251,-2.261; 4 3.251,-2.261
1X05 = drill 1.016 long: 1 -5.08,0; 2 -2.54,0; 3 0,0; 4 2.54,0; 5 5.08,0
TC26H = drill 0.813 pad 1.676: 1 -1.27,0; 2 1.27,0
QFP50P1200X1200X160-64N = smd 1.473 x 0.279: 1 -5.613,3.759; 2 -5.613,3.251; 3 -5.613,2.743; 4 -5.613,2.261; 5 -5.613,1.753; 6 -5.613,1.245; 7 -5.613,0.762; 8 -5.613,0.254; 9 -5.613,-0.254; 10 -5.613,-0.762; 11 -5.613,-1.245; 12 -5.613,-1.753; 13 -5.613,-2.261; 14 -5.613,-2.743; 15 -5.613,-3.251; 16 -5.613,-3.759; 33 5.613,-3.759; 34 5.613,-3.251; 35 5.613,-2.743; 36 5.613,-2.261; 37 5.613,-1.753; 38 5.613,-1.245; 39 5.613,-0.762; 40 5.613,-0.254; 41 5.613,0.254; 42 5.613,0.762; 43 5.613,1.245; 44 5.613,1.753; 45 5.613,2.261; 46 5.613,2.743; 47 5.613,3.251; 48 5.613,3.759 | smd 0.279 x 1.473: 17 -3.759,-5.613; 18 -3.251,-5.613; 19 -2.743,-5.613; 20 -2.261,-5.613; 21 -1.753,-5.613; 22 -1.245,-5.613; 23 -0.762,-5.613; 24 -0.254,-5.613; 25 0.254,-5.613; 26 0.762,-5.613; 27 1.245,-5.613; 28 1.753,-5.613; 29 2.261,-5.613; 30 2.743,-5.613; 31 3.251,-5.613; 32 3.759,-5.613; 49 3.759,5.613; 50 3.251,5.613; 51 2.743,5.613; 52 2.261,5.613; 53 1.753,5.613; 54 1.245,5.613; 55 0.762,5.613; 56 0.254,5.613; 57 -0.254,5.613; 58 -0.762,5.613; 59 -1.245,5.613; 60 -1.753,5.613; 61 -2.261,5.613; 62 -2.743,5.613; 63 -3.251,5.613; 64 -3.759,5.613
POWER-CHOKE_WE-TPC = smd 6.3 x 2.2: 1 0,2.05; 2 0,-2.05
W5500 = smd 1.5 x 0.3: 1 -4.45,2.75; 2 -4.45,2.25; 3 -4.45,1.75; 4 -4.45,1.25; 5 -4.45,0.75; 6 -4.45,0.25; 7 -4.45,-0.25; 8 -4.45,-0.75; 9 -4.45,-1.25; 10 -4.45,-1.75; 11 -4.45,-2.25; 12 -4.45,-2.75; 25 4.45,-2.75; 26 4.45,-2.25; 27 4.45,-1.75; 28 4.45,-1.25; 29 4.45,-0.75; 30 4.45,-0.25; 31 4.45,0.25; 32 4.45,0.75; 33 4.45,1.25; 34 4.45,1.75; 35 4.45,2.25; 36 4.45,2.75 | smd 0.3 x 1.5: 13 -2.75,-4.45; 14 -2.25,-4.45; 15 -1.75,-4.45; 16 -1.25,-4.45; 17 -0.75,-4.45; 18 -0.25,-4.45; 19 0.25,-4.45; 20 0.75,-4.45; 21 1.25,-4.45; 22 1.75,-4.45; 23 2.25,-4.45; 24 2.75,-4.45; 37 2.75,4.45; 38 2.25,4.45; 39 1.75,4.45; 40 1.25,4.45; 41 0.75,4.45; 42 0.25,4.45; 43 -0.25,4.45; 44 -0.75,4.45; 45 -1.25,4.45; 46 -1.75,4.45; 47 -2.25,4.45; 48 -2.75,4.45
QS = drill 0.61 long: 1 -2.54,0; 2 2.54,0

### Placement (x,y rotation side)
ADE-7  -117,48 0 top  (outside the outline)
ADE-C1  -148.13,27.71 0 top  (outside the outline)
ADE-C2  -158.49,29.82 0 top  (outside the outline)
ADE-C3  -147.39,24.82 0 top  (outside the outline)
ADE-C4  -151.44,24.82 0 top  (outside the outline)
ADE-C5  -158.74,23.82 0 top  (outside the outline)
ADE-C6  -158.79,26.82 0 top  (outside the outline)
ADE-C7  -155.09,23.82 0 top  (outside the outline)
ADE-C8  -155.14,26.82 0 top  (outside the outline)
ADE-C9  -154.77,31.22 0 top  (outside the outline)
ADE-C10  -153.85,37.22 0 top  (outside the outline)
ADE-C11  -146.01,31.22 0 top  (outside the outline)
ADE-C12  -146.93,36.22 0 top  (outside the outline)
ADE-C13  -165,25 0 top  (outside the outline)
ADE-C14  -164.5,31.5 0 top  (outside the outline)
ADE-R1  -149.17,34.03 0 top  (outside the outline)
ADE-R2  -150.26,37.11 0 top  (outside the outline)
ADE-R3  -151.32,40.11 0 top  (outside the outline)
ADE-R4  -117,51 0 top  (outside the outline)
ADE-R5  -150.9,30.95 0 top  (outside the outline)
ADE-R6  -158.29,33.03 0 top  (outside the outline)
ADE-R8  -152.87,33.95 0 top  (outside the outline)
ADE-R9  -147.26,39.03 0 top  (outside the outline)
ADE-R10  -117,45 0 top  (outside the outline)
ADE-R12  -156.23,35.03 0 top  (outside the outline)
ADE-XTAL  -149.23,18.82 0 top  (outside the outline)
ADER-11  -151.32,28.03 0 top  (outside the outline)
CT1  -131,52 0 top  (outside the outline)
CT2  -147,52 0 top  (outside the outline)
CT3  -163,52 0 top  (outside the outline)
DCDC-3.5V  94.91,-43.19 0 top  (outside the outline)
ESP8266  137.5,41.5 0 top  (outside the outline)
ESP-C1  142,30 0 top  (outside the outline)
ESP-GND  131,23.5 0 top  (outside the outline)
ESP-GPIO0  131,17 0 top  (outside the outline)
ESP-USART  129.5,10.5 0 top  (outside the outline)
ESP-VDD  131,31 0 top  (outside the outline)
ETH-C1  9,53.5 90 top
ETH-C2  3,53.5 270 top
ETH-C3  9,53.5 90 bottom
ETH-C4  6,53.5 270 top
ETH-R1  18,53.5 270 top
ETH-R2  15,53.5 270 top
ETH-R3  12,53.5 270 top
ETH-R4  12.18,67.33 90 bottom
ETH-R5  8.41,67.3 90 bottom
ETH-R6  3,53.5 270 bottom
ETH-R7  6,53.5 90 bottom
ETHERNET  10.39,67.08 0 top
IC1  -166.67,124.97 0 top  (outside the outline)
IC2  32.45,-39.34 0 top  (outside the outline)
IC3  12.48,-39.84 0 top  (outside the outline)
IC4  -164.59,16.23 0 top  (outside the outline)
J5  102,-20 0 top  (outside the outline)
LCD-R1  -54,114 0 top  (outside the outline)
LCD_ILI9341  -57.4,108.09 0 top  (outside the outline)
LCD_SD  -61.53,114.09 0 top  (outside the outline)
SIM900-ANT  -127.52,137.56 0 top  (outside the outline)
SIM900-C1  -146.78,130.93 0 top  (outside the outline)
SIM900-C2  -136.39,131.39 0 top  (outside the outline)
SIM900-C3  -147,121 0 top  (outside the outline)
SIM900-C4  -115.71,119.11 0 top  (outside the outline)
SIM900-C5  -123.82,116.11 0 top  (outside the outline)
SIM900-C6  -111.32,130.19 0 top  (outside the outline)
SIM900-LED1  -140.62,117.85 270 top  (outside the outline)
SIM900-LED2  -139.62,111.66 270 top  (outside the outline)
SIM900-R1  -117.39,114.19 0 top  (outside the outline)
SIM900-R2  -133.42,117.19 0 top  (outside the outline)
SIM900-R3  -127.04,111.19 0 top  (outside the outline)
SIM900-R4  -123.94,131.19 0 top  (outside the outline)
SIM900-R5  -118.56,128.19 0 top  (outside the outline)
SIM900-R6  -116.6,124.11 0 top  (outside the outline)
SIM900-R7  -129.18,127.19 0 top  (outside the outline)
SIM900-R8  -131.8,122.19 0 top  (outside the outline)
SIM900-R9  -124.49,122.11 0 top  (outside the outline)
SIM900-R10  -152,103 0 top  (outside the outline)
SIM900-R11  -152,97 0 top  (outside the outline)
SIM900-T1  -136.34,123.44 0 top  (outside the outline)
SIM900-T2  -133.42,110.44 0 top  (outside the outline)
SIM900-T3  -147,108 0 top  (outside the outline)
SIM900-T4  -151,108 0 top  (outside the outline)
SIM_C1  27,-15.5 0 bottom  (outside the outline)
SIM_C2  27,-12.5 0 bottom  (outside the outline)
SIM_HOLDER  6,-20.5 0 top  (outside the outline)
SR_OUT1  32.5,-56 180 top  (outside the outline)
SR_OUT2  12.5,-56.5 180 top  (outside the outline)
STM-C1  -31.61,134.22 0 top  (outside the outline)
STM-C2  -27.78,133.22 0 top  (outside the outline)
STM-C3  -30.95,143.14 0 top  (outside the outline)
STM-C5  -40.55,141.14 0 top  (outside the outline)
STM-C6  -34.2,139.14 0 top  (outside the outline)
STM-C7  -37.4,131.14 0 top  (outside the outline)
STM-C8  -36.5,135.14 0 top  (outside the outline)
STM-C9  -42.78,131.14 0 top  (outside the outline)
STM-C10  -32.02,131.14 0 top  (outside the outline)
STM-C11  -41.64,135.14 0 top  (outside the outline)
STM-C12  -28.26,140.14 0 top  (outside the outline)
STM-C13  -27.88,137.14 0 top  (outside the outline)
STM-L1  -28.03,130.06 0 top  (outside the outline)
STM-R1  -34.39,144.06 0 top  (outside the outline)
STM-R2  -39.39,127.44 0 top  (outside the outline)
STM-R3  -32.74,128.44 0 top  (outside the outline)
STM-S1  -48.37,130.39 0 top  (outside the outline)
STM-S2  -46.53,138.39 0 top  (outside the outline)
STM-USART  -42.95,147.52 0 top  (outside the outline)
STM-XTAL1  -17.49,138.02 0 top  (outside the outline)
STM-XTAL2  -11.14,138.02 0 top  (outside the outline)
STM_CHIP  -27.29,160.18 0 top  (outside the outline)
SYS-C1  92.5,81.5 0 top
SYS-C2  98.5,81.5 0 top
SYS-C3  112,1 0 top  (outside the outline)
SYS-C4  112,-5 0 top  (outside the outline)
SYS-L1  110.5,-16.5 0 top  (outside the outline)
SYS-R1  109,81.5 0 top  (outside the outline)
SYS-R2  112,-9 0 top  (outside the outline)
U2  65,47 0 top
VAC_IN  -174,44 0 top  (outside the outline)
W5500-C1  62.02,21.72 0 top
W5500-C2  57.67,10.72 0 top
W5500-C3  57.6,21.64 0 top
W5500-C4  61.37,14.72 0 top
W5500-C5  46.5,10.5 0 top
W5500-C6  46.5,28.5 0 top
W5500-C7  46.5,25.5 0 top
W5500-C8  46.5,22.5 0 top
W5500-C9  46.5,19.5 0 top
W5500-C10  46.5,16.5 0 top
W5500-C11  46.5,13.5 0 top
W5500-HD1  72.28,34.69 0 top
W5500-HD2  72.28,27.07 0 top
W5500-R1  63.5,55.5 270 top
W5500-R2  60.5,55.5 270 bottom
W5500-R3  60.5,55.5 270 top
W5500-R4  63.5,55.5 270 bottom
W5500-R5  66.5,55.5 270 top
W5500-R6  66.5,55.5 270 bottom
W5500-R7  69.5,55.5 270 top
W5500-R8  69.5,55.5 270 bottom
W5500-R9  72.5,55.5 90 top
W5500-R10  69.98,18.56 0 top
W5500-R11  57.95,18.56 0 top
W5500-R12  57.47,33.37 0 top
W5500-R13  57.47,37.72 0 top
W5500-XTAL  61.54,27.16 0 top

### Tracks (layer width: path | path; a pad name or v marks a point on that pad's centre or on a via)
+5V  (7 unrouted)
ACTLED  (1 unrouted)
ADE_APCF  (1 unrouted)
ADE_CS  (1 unrouted)
ADE_IRQ  (1 unrouted)
ADE_MISO  (1 unrouted)
ADE_MOSI  (1 unrouted)
ADE_SCK  (1 unrouted)
ADE_VARCF  (1 unrouted)
AGND  (32 unrouted)
  Top 0.61: ETHERNET.4 11.03,59.46 ETHERNET.5
AVDD  (2 unrouted)
BOOT0  (1 unrouted)
BOOT1  (1 unrouted)
DGND  (via drill 0.6)  (64 unrouted)
  Top 0.305: W5500-R8.2 69.5,54 v69,53.5
  Top 0.61: ETH-C3.1 v9,50.5 | v30,-15.5 32.2,-15.5 SIM_HOLDER.6 | IC2.8 36.9,-39.9 36,-39 33,-39 31.82,-37.81 IC2.13 | IC3.8 16.93,-40.42 16.5,-40 13,-40 11.85,-38.84 IC3.13
  Bottom 0.305: v69,53.5 69.5,54 W5500-R8.2
  Bottom 0.61: v9,50.5 ETH-C3.1 | SIM_C2.1 SIM_C1.1 v30,-15.5
ESP_GPIO0  (1 unrouted)
ESP_RX  (2 unrouted)
ESP_TX  (2 unrouted)
ETH_CS  (1 unrouted)
ETH_MISO  (1 unrouted)
ETH_MOSI  (1 unrouted)
ETH_RSTN  (2 unrouted)
ETH_SCK  (1 unrouted)
GESP  (4 unrouted)
GEXT  (1 unrouted)
GND  (13 unrouted)
IBN  (2 unrouted)
ICN  (2 unrouted)
LCD_CS  (1 unrouted)
LCD_D/C  (1 unrouted)
LCD_LED  (1 unrouted)
LCD_MISO  (2 unrouted)
LCD_MOSI  (2 unrouted)
LCD_RESET  (1 unrouted)
LCD_SCK  (2 unrouted)
LINKLED  (1 unrouted)
N$1  (2 unrouted)
N$2  (2 unrouted)
N$3  (1 unrouted)
N$4  (3 unrouted)
N$5  (1 unrouted)
N$6  (2 unrouted)
N$7  (2 unrouted)
N$8  (1 unrouted)
N$9  (1 unrouted)
N$11
  Bottom 0.61: ETH-R4.2 12.18,69.68 13,70.5 14.13,70.5 ETHERNET.10
N$12
  Bottom 0.61: ETH-R5.2 8.41,70.17 ETHERNET.11
N$13  (1 unrouted)
N$14  (1 unrouted)
N$15  (1 unrouted)
N$16  (1 unrouted)
N$17  (1 unrouted)
N$18  (2 unrouted)
N$19  (1 unrouted)
N$20  (1 unrouted)
N$21  (2 unrouted)
N$22
  Top 0.61: ETH-C2.1 3,59 4.5,60.5 6.99,60.5 ETHERNET.7
N$23
  Top 0.61: ETH-C1.2 ETH-R3.1 12.29,54.65 ETHERNET.3
N$24  (2 unrouted)
N$25  (2 unrouted)
N$26
  Top 0.61: ETH-C4.1 6,58.13 ETHERNET.8
N$27  (2 unrouted)
N$28  (2 unrouted)
N$29
  Bottom 0.61: ETHERNET.6 8.48,56.02 9,55.5 ETH-C3.2 ETH-R7.2 ETH-R6.1
N$30  (2 unrouted)
N$31  (2 unrouted)
N$32  (2 unrouted)
N$33  (2 unrouted)
N$34  (2 unrouted)
N$35  (2 unrouted)
N$36  (1 unrouted)
N$37  (5 unrouted)
N$38  (1 unrouted)
N$39  (2 unrouted)
N$40  (2 unrouted)
N$41  (1 unrouted)
N$42  (1 unrouted)
N$43  (1 unrouted)
N$44  (1 unrouted)
N$45  (1 unrouted)
N$46  (1 unrouted)
N$47  (2 unrouted)
N$48  (2 unrouted)
N$49  (3 unrouted)
N$50  (3 unrouted)
N$51  (2 unrouted)
N$57  (via drill 0.6)
  Top 0.305: v69.5,57.75 70.25,57.75 70.5,57.5 70.5,54 69.25,52.75 67.5,52.75 67.25,52.5 U2.38
  Bottom 0.305: W5500-R8.1 v69.5,57.75
N$58
  Top 0.305: U2.39 66.75,53 67,53.25 67.75,53.25 68.25,53.75 68.25,56 68.5,56.25 69.4,56.25 W5500-R7.1
N$59  (via drill 0.6)
  Top 0.305: v66.5,57.75 67.25,57.75 67.5,57.5 67.5,54 67.25,53.75 66.5,53.75 66.25,53.5 U2.40
  Bottom 0.305: W5500-R6.1 v66.5,57.75
N$60
  Top 0.305: U2.41 65.75,53.5 65.25,54 65.25,56 65.6,56.35 W5500-R5.1
N$61  (via drill 0.6)
  Top 0.305: v63.5,57.75 64.25,57.75 64.5,57.5 64.5,54 65.25,53.25 U2.42
  Bottom 0.305: W5500-R4.1 v63.5,57.75
N$62
  Top 0.305: U2.43 64.75,53 63.5,54.25 W5500-R1.2
N$63  (via drill 0.6)
  Top 0.305: U2.44 64.25,52.75 63.5,53.5 62,53.5 v61.75,53.75
  Bottom 0.305: W5500-R2.2 61.35,54.65 61.75,54.25 v61.75,53.75
N$64
  Top 0.305: W5500-R3.2 60.5,53.5 61,53 63.25,53 63.75,52.5 U2.45
NRST  (2 unrouted)
Q1  (via drill 0.6)
  Top 0.61: IC2.15 29.27,-38.27 v31,-40
  Bottom 0.61: SR_OUT1.1 40.85,-49.65 42,-48.5 42,-46 40,-44 40,-42.5 37.5,-40 v31,-40
Q2  (via drill 0.6)
  Top 0.61: IC2.1 27.92,-42.5 26.5,-42.5 25.5,-43.5 v25.5,-44.5
  Bottom 0.61: SR_OUT1.2 36.31,-54.69 35,-56 28,-56 25.5,-53.5 v25.5,-44.5
Q3  (via drill 0.6)
  Top 0.61: IC2.2 29.27,-43.73 28.5,-44.5 28.5,-45.5 v29,-46 | SR_OUT1.3 33.77,-49.48 v35.5,-47.75
  Bottom 0.61: v35.5,-47.75 35.5,-47.5 34,-46 v29,-46
Q4  (via drill 0.6)
  Top 0.61: IC2.3 30.55,-44.45 v30.5,-44.5
  Bottom 0.61: SR_OUT1.4 33.77,-53.73 33,-54.5 28.5,-54.5 27,-53 27,-45.5 28,-44.5 v30.5,-44.5
Q5
  Top 0.61: IC2.4 31.82,-49.06 SR_OUT1.5
Q6  (via drill 0.6)
  Top 0.61: SR_OUT1.6 31.23,-53.73 32,-54.5 37,-54.5 38,-53.5 v38,-44.5 | IC2.5 33.09,-44.41 v33,-44.5
  Bottom 0.61: v33,-44.5 v38,-44.5
Q7  (via drill 0.6)
  Top 0.61: SR_OUT1.7 28.69,-48.31 29.5,-47.5 v30.5,-47.5 | IC2.6 34.35,-46.65 33.5,-47.5 v33,-47.5
  Bottom 0.61: v30.5,-47.5 v33,-47.5
Q8  (via drill 0.6)
  Top 0.61: IC2.7 35.62,-45.12 v36.5,-46 | SR_OUT1.8 28.69,-54.69 30,-56 38,-56 40,-54 v40,-47
  Bottom 0.61: v36.5,-46 39,-46 v40,-47
Q9  (via drill 0.6)
  Top 0.61: IC3.15 9.3,-39.3 v10,-40
  Bottom 0.61: SR_OUT2.1 19.85,-50.15 21,-49 21,-46 18.5,-43.5 18.5,-41.5 17.5,-40.5 10.5,-40.5 v10,-40
Q10  (via drill 0.6)
  Top 0.61: IC3.1 7.95,-43 7,-43 6.5,-43.5 v6.5,-44
  Bottom 0.61: SR_OUT2.2 16.31,-54.69 14.5,-56.5 7.5,-56.5 5.5,-54.5 5.5,-45 v6.5,-44
Q11  (via drill 0.6)
  Top 0.61: IC3.2 9.3,-44.2 9,-44.5 v9,-46.5 | v15.5,-48 13.77,-49.73 SR_OUT2.3
  Bottom 0.61: v9,-46.5 12,-46.5 12.5,-46 14.5,-46 15.5,-47 v15.5,-48
Q12  (via drill 0.6)
  Top 0.61: IC3.3 10.57,-44.92 v10.5,-45
  Bottom 0.61: SR_OUT2.4 13.77,-54.23 13,-55 8,-55 7,-54 7,-46 8,-45 v10.5,-45
Q13
  Top 0.61: SR_OUT2.5 11.85,-49.53 IC3.4
Q14  (via drill 0.6)
  Top 0.61: SR_OUT2.6 11.23,-54.23 12,-55 17,-55 18,-54 v18,-45.5 | IC3.5 v13.12,-44.5 v13.11,-44.5
  Bottom 0.61: v18,-45.5 16.5,-45.5 15.5,-44.5 v13.11,-44.5
Q15  (via drill 0.6)
  Top 0.61: SR_OUT2.7 8.69,-48.81 9.5,-48 v10.5,-48 | IC3.6 14.38,-46.62 v13.5,-47.5
  Bottom 0.61: v10.5,-48 13,-48 v13.5,-47.5
Q16  (via drill 0.6)
  Top 0.61: IC3.7 15.65,-45.66 v16.75,-46.75 | SR_OUT2.8 8.69,-55.19 10,-56.5 17.5,-56.5 19.5,-54.5 v19.5,-48
  Bottom 0.61: v16.75,-46.75 17,-47 18.5,-47 v19.5,-48
QS  (1 unrouted)
RXN  (via drill 0.6)  (1 unrouted)
  Top 0.61: ETH-C4.2 v6,50.5
  Bottom 0.61: v6,50.5 ETH-C4.2
RXP  (via drill 0.6)  (1 unrouted)
  Top 0.61: v3,50.5 ETH-R6.2
  Bottom 0.61: ETH-R6.2 v3,50.5
SD_CS  (1 unrouted)
SERIAL_RX  (1 unrouted)
SERIAL_TX  (1 unrouted)
SIM900_PWRKEY  (1 unrouted)
SIM900_RESET  (1 unrouted)
SIM_NETLIGHT  (1 unrouted)
SIM_PWRKEY  (1 unrouted)
SIM_RESET  (1 unrouted)
SIM_RX  (1 unrouted)
SIM_STATUS  (1 unrouted)
SIM_TX  (1 unrouted)
SR_DS  (1 unrouted)
SR_RST  (2 unrouted)
SR_SHCP  (2 unrouted)
SR_STCP  (2 unrouted)
SWO  (1 unrouted)
TXN  (1 unrouted)
  Top 0.61: ETH-R2.1 15,56.76 ETHERNET.2
TXP  (1 unrouted)
  Top 0.61: ETH-R1.1 18,57.56 ETHERNET.1
USIM_CLK  (1 unrouted)
USIM_DATA  (1 unrouted)
USIM_RESET  (1 unrouted)
USIM_VCC  (5 unrouted)
VCC  (17 unrouted)
  Top 0.61: ETH-R1.2 ETH-R2.2 ETH-R3.2
VDD  (via drill 0.6)  (36 unrouted)
  Top 0.61: ETHERNET.12 4.07,72.56 5.5,74 15.5,74 16.5,73 16.5,72.19 ETHERNET.9 | v60.5,58 W5500-R2.1 W5500-R1.1
  Bottom 0.61: v60.5,58 W5500-R2.1
VESP  (5 unrouted)
VEXT  (1 unrouted)